# EAGLE design Adafruit 40pin TFT friend (EAGLE 8.3.2)
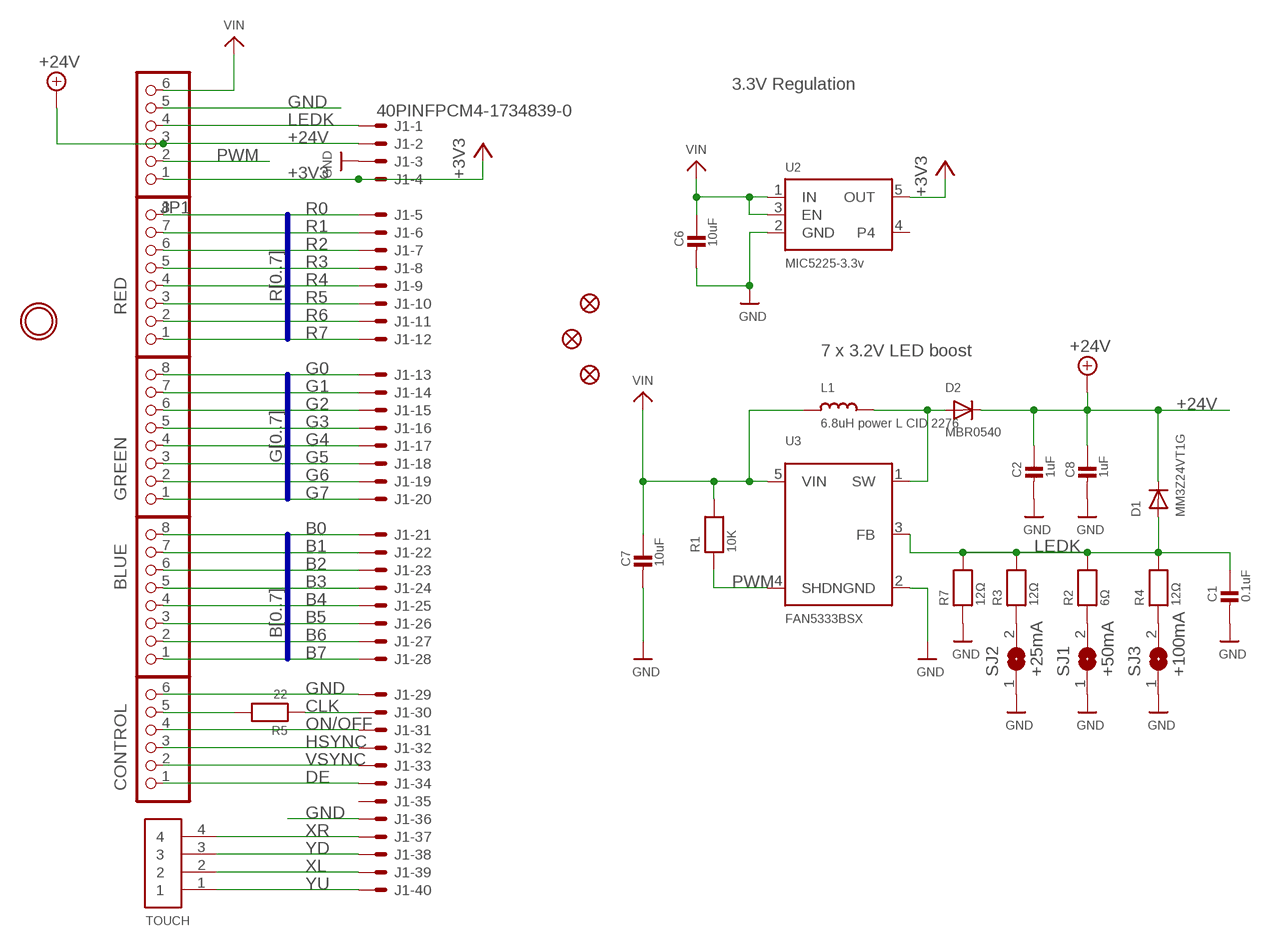
[diagram p0: schematic, sheet 1]

## Parts
BLUE  PINHD-1X8BIG  [1X08-BIG]
C1  0.1uF  CAP_CERAMIC_0805MP  [_0805MP]
C2  1uF  CAP_CERAMIC_0805MP  [_0805MP]
C6  10uF  CAP_CERAMIC_0805MP  [_0805MP]
C7  10uF  CAP_CERAMIC_0805MP  [_0805MP]
C8  1uF  CAP_CERAMIC_0805MP  [_0805MP]
CONTROL  PINHD-1X6B  [1X06-BIG]
D1  MM3Z24VT1G  DIODESMA  [SMADIODE]
D2  MBR0540  DIODESOD-123  [SOD-123]
FID1  FIDUCIAL""  [FIDUCIAL_1MM]
FID2  FIDUCIAL""  [FIDUCIAL_1MM]
FID3  FIDUCIAL""  [FIDUCIAL_1MM]
GREEN  PINHD-1X8BIG  [1X08-BIG]
J1  40PINFPCM4-1734839-0  [4-1734839-0]
JP1  PINHD-1X6B  [1X06-BIG]
L1  6.8uH power L CID 2276  INDUCTORNR5040  [INDUCTOR_5X5MM_NR5040_NOTHERMALS]
R1  10K  RESISTOR_0805MP  [_0805MP]
R2  6Ω  RESISTOR_0805MP  [_0805MP]
R3  12Ω  RESISTOR_0805MP  [_0805MP]
R4  12Ω  RESISTOR_0805MP  [_0805MP]
R5  22  RESISTOR_0805MP  [_0805MP]
R7  12Ω  RESISTOR_0805MP  [_0805MP]
RED  PINHD-1X8BIG  [1X08-BIG]
SJ1  +50mA  SOLDERJUMPER  [SOLDERJUMPER_ARROW_NOPASTE]
SJ2  +25mA  SOLDERJUMPER  [SOLDERJUMPER_ARROW_NOPASTE]
SJ3  +100mA  SOLDERJUMPER  [SOLDERJUMPER_ARROW_NOPASTE]
TOUCH  1X4-BIG  [1X04-BIG]
U2  MIC5225-3.3v  VREG_SOT23-5  [SOT23-5]
U3  FAN5333BSX  FAN5331  [SOT23-5@1]
U$7  MOUNTINGHOLE2.5  [MOUNTINGHOLE_2.5_PLATED]

## Nets
+3V3: J1.4 JP1.1 U2.5(OUT)
+24V: C2.1 C8.1 D1.C D2.C J1.2 JP1.3
B0: BLUE.8 J1.21
B1: BLUE.7 J1.22
B2: BLUE.6 J1.23
B3: BLUE.5 J1.24
B4: BLUE.4 J1.25
B5: BLUE.3 J1.26
B6: BLUE.2 J1.27
B7: BLUE.1 J1.28
CLK: J1.30 R5.1
DE: CONTROL.1 J1.34
G0: GREEN.8 J1.13
G1: GREEN.7 J1.14
G2: GREEN.6 J1.15
G3: GREEN.5 J1.16
G4: GREEN.4 J1.17
G5: GREEN.3 J1.18
G6: GREEN.2 J1.19
G7: GREEN.1 J1.20
GND: C1.2 C2.2 C6.2 C7.2 C8.2 CONTROL.6 J1.3 J1.29 J1.36 JP1.5 R7.1 SJ1.1 SJ2.1 SJ3.1 U2.2(GND) U3.2(GND)
HSYNC: CONTROL.3 J1.32
LEDK: C1.1 D1.A J1.1 JP1.4 R2.2 R3.2 R4.2 R7.2 U3.3(FB)
N$1: R2.1 SJ1.2
N$2: R3.1 SJ2.2
N$3: R4.1 SJ3.2
N$4: CONTROL.5 R5.2
N$5: D2.A L1.P$2 U3.1(SW)
ON/OFF: CONTROL.4 J1.31
PWM: JP1.2 R1.1 U3.4(SHDN)
R0: J1.5 RED.8
R1: J1.6 RED.7
R2: J1.7 RED.6
R3: J1.8 RED.5
R4: J1.9 RED.4
R5: J1.10 RED.3
R6: J1.11 RED.2
R7: J1.12 RED.1
VIN: C6.1 C7.1 JP1.6 L1.P$1 R1.2 U2.1(IN) U2.3(EN) U3.5(VIN)
VSYNC: CONTROL.2 J1.33
XL: J1.39 TOUCH.2
XR: J1.37 TOUCH.4
YD: J1.38 TOUCH.3
YU: J1.40 TOUCH.1
Unconnected: J1.35 U2.4

## Buses
R[0..7]
G[0..7]
B[0..7]

## Notes on the sheet
- 3.3V Regulation
- 7 x 3.2V LED boost

## Library data of the parts
BLUE GREEN RED = adafruit:PINHD-1X8: PIN HEADER
C1 C2 C6-C8 = microbuilder:CAP_CERAMIC: Ceramic Capacitors For new designs, use the packages preceded by an '_' character since they are more reliable: The following footprints should be used on most boards: _0402 - Standard footprint for regular board layouts _0603 - Standard footprint for regular board layouts _0805 - Standard footprint for regular board layouts For extremely tight-pitch boards where space is at a premium, the following 'micro-pitch' footprints can be used (smaller pads, no silkscreen outline, etc.): _0402MP - Micro-pitch footprint for very dense/compact boards _0603MP - Micro-pitch footprint for very dense/compact boards _0805MP - Micro-pitch footprint for very dense/compact boards Commonly Stocked Parts 0402 - 0402 Surface Mount Capacitors 16pF 50V 5% [Digikey: 445-4899-2-ND] 18pF 50V 5% [Digikey: 490-1281-2-ND] 22pF 50V 5% [Digikey: 490-1283-2-ND] 68pF 50V 5% [Digikey: 490-1289-2-ND] 0.1uF 10V 10% [Digikey: 490-1318-2-ND] 1.0uF 6.3V 10% [Digikey: 490-1320-2-ND] 0603 - 0603 Surface Mount Capacitors 16 pF 50V 5% [Digikey: 445-5051-2-ND] 22 pF 50V [Digikey: PCC220ACVTR-ND] 33 pF 50V 5% [Digikey: 490-1415-1-ND] 56pF 50V 5% [Digikey: 490-1421-1-ND] 220pF 50V 5% [Digikey: 445-1285-1-ND] 680 pF 50V 2200 pF 50V 5% C0G [Digikey: 445-1297-1-ND] 5600 pF 100V 5% X7R [Digikey: 478-3711-1-ND] 0.1 µF 25V 10% [Digikey: PCC2277TR-ND] 0.22 µF 16V 10% X7R [Digikey: 445-1318-1-ND] 1.0 µF 25V 10% [Digikey: 445-5146-2-ND] 0603 - RF Specific 3pF 250V +/-0.1pF RF [Digikey: 712-1347-1-ND] 18 pF 250V 5% [Digikey: 478-3505-1-ND or 712-1322-1-ND] 56 pF 250V 5% C0G RF [Digikey: 490-4867-1-ND] 68 pF 250V RF [Digikey: 490-4868-1-ND] 0805 - 0805 Surface Mount Capacitors 220 pF 250V 2% RF Ceramic Capacitor [Digikey: 712-1398-1-ND] 1000 pF 50V 2% NP0 Ceramic Capacitor [Digikey: 478-3760-1-ND] 0.1 µF 25V 10% Ceramic Capacitor [Digikey: PCC1828TR-ND] 1.0 µF 16V 10% Ceramic Capacitor[Digikey: 490-1691-2-ND] 10.0 µF 10V 10% Ceramic Capacitor[Digikey: 709-1228-1-ND] 10.0 uF 16V 10% Ceramic Capacitor [Digikey: 478-5165-2-ND] 47 uF 6.3V 20% Ceramic Capacitor [Digikey: 587-1779-1-ND or 399-5506-1-ND] 1206 - 1206 Surface Mount Capacitors 47uF 10V 20% Ceramic Capacitor [Digikey: 490-5528-1-ND or 399-5508-1-ND or 445-6010-1-ND] 100uF 6.3V -20%, +80% Y5V Ceramic Capacitor (Digikey: 490-4512-1-ND, Mouser: 81-GRM31CF50J107ZE1L)
CONTROL JP1 = adafruit:PINHD-1X6: PIN HEADER
D1 D2 = microbuilder:DIODE: Diode SMA Model Volts Amps Type Vf Vr Digikey # Notes SSA34-E3 40V 3A Schottky 480mV @ 3A 200uA @ 40V SSA34-E3/61TGITR-ND CDBA120-G 20V 1A Schottky 500mV @ 1A 500uA @ 20V 641-1014-6-ND REEL MBRA210 10V 2A Schottky 350mV @ 2A 700uA @ 10V MBRA210LT3 SOD-123 Model Volts Amps Type Vf Vr Order # Notes BAT54T1G 30V 200mA Schottky 800mV @ 200mA 2uA @ 25V BAT54T1GOSTR-ND B0530W 30V 500mA Schottky 430mV @ 500mA 130uA @ 30V B0530W-FDICT-ND REEL MBR120 20V 1A Schottky 340mV @ 1A MBR120VLSFT1GOSCT-ND SOD-323 Model Volts Amps Type Vf Vr Order # Notes PMEG2005EJ 20V 500mA Schottky 355mV @ 500mA 568-4110-1-ND ZLLS410 10V 570mA Schottky 380mV @ 570mA ZLLS410CT-ND 1N4148WS 75V 150mA Silicon/Simple 1V 1N4148WSFSCT-ND REEL SOD-523 Model Volts Amps Type Vf Vr Order # Notes BAT54XV2 30V 200mA Schottky 0.8V @ 100mA BAT54XV2CT-ND TB751S 30V 30mA Schottky RB751S-40TE61CT-ND SOT23-R/W (R = Solder Paste/Reflow Ovens, W = Hand-Soldering) Model Volts Amps Type Vf Vr Order # Notes BAT54FILM 40V 300mA Schottky 497-7162-1-ND
FID1-FID3 = microbuilder:FIDUCIAL: Fiducial Alignment Points Various fiducial points for machine vision alignment.; BOM: EXCLUDE
J1 = adafruit:40PINFPC: OMRON FPC Connector Source : http://www.omron.com/ecb/products/pdf/fpc.pdf XF2M-4015-rev is good for connecting up 'PSP' SHARP LQ043 LCDs
L1 = microbuilder:INDUCTOR: Inductors 0603: 10nH Ceramic Inductor - microwire antenna/RF (Digikey: 712-1434-2-ND) 0805: 560nH Ceramic Inductor - RF (Digikey: 553-1047-1-ND) 270nH Ceramic Inductor - Q = 40@250MHz, +-5%, 1 Ohm DC Resistance (Digikey: 535-10506-2-ND) 1007 (2518 Metric) SMT: 10µH 10% 250mOhm 820mA 1007 Inductor (Digikey: 587-2189-1-ND) 22µH 10% 500mOhm 580mA 1007 Inductor (Digikey: 587-2190-1-ND) 47µH 10% 950mOhm 420mA 1007 Inductor (Digikey: 587-2191-1-ND) 47µH 5% 100mOhm 1A 1008 Inductor (Digikey: 732-1816-1-ND) 5.0x5.0mm (Taiyo Yuden NR5040 Series) 6.8µH 20% 2.3A 64mOhm Inductor (Digikey: 587-2374-2-ND) 5.0x5.0mm (TDK VLC5045 Series) 4.7µH 20% 3.3A 34mOhm Inductor (Digikey: 445-6526-1-ND) 6.8µH 20% 2.7A 46mOhm Inductor (Digikey: 445-6527-1-ND) 6.0x6.0mm (TDK VLC6045 Series) 4.7µH 20% 3.8A 27mOhm Inductor (Digikey: 445-6538-2-ND) 6.8µH 20% 3A 41mOhm Inductor (Digikey: 445-6540-1-ND) 6.2µH 30% 2.2A 45mOhm Inductor (Digikey: SRR5028-6R2YCT-ND) - Not TDK VLC6045 but footprint should match 6.0x6.0mm (TDK SLF6045 Series) 6.8uH 30% 2A 33mOhm Inductor (Digikey: 445-4572-1-ND, Mouser: 810-SLF645T6R8N2R0PF) 6.0x6.0mm (Sumida CDRH5D28 Series) 6.2uH 30% 1.8A 45mOhm Inductor (Digikey: 308-1542-1-ND) Taiyo Yuden NR3015T2R2M - 2.2uH 20% 1.5A (Digikey: 587-1648-2-ND, Mouser: 963-NR3015T2R2M) - Used with TI TPS62172 CoilCraft RFID Transponder Coil - MA5532-AE (For use with AS3935 Lightning Sensor)
R1-R5 R7 = microbuilder:RESISTOR: Resistors For new designs, use the packages preceded by an '_' character since they are more reliable: The following footprints should be used on most boards: _0402 - Standard footprint for regular board layouts _0603 - Standard footprint for regular board layouts _0805 - Standard footprint for regular board layouts For extremely tight-pitch boards where space is at a premium, the following 'micro-pitch' footprints can be used (smaller pads, no silkscreen outline, etc.): _0402MP - Micro-pitch footprint for very dense/compact boards _0603MP - Micro-pitch footprint for very dense/compact boards _0805MP - Micro-pitch footprint for very dense/compact boards
SJ1-SJ3 = microbuilder:SOLDERJUMPER: SMD Solder JUMPER Solder the two pads together to create a connection, or remove the solder to break it. REFLOW - Use this footprint for solder paste and reflow ovens. WAVE - Use this footprint for hand-soldering (larger pads). CLOSED - Has a trace between the two pads to ensure it is closed by default. The trace needs to be cut to disable the jumper, and can be closed again by creating a solder bridge between the two pads.; BOM: EXCLUDE
TOUCH = adafruit:1X4: 4-pin connector
U2 = microbuilder:VREG_SOT23-5: SOT23-5 Fixed Voltage Regulators Part Current Out V Out V In V Dropout θJA (°C/W) TJ (°C) Digikey Part No. ADP121 150mA 3.3V 3.4-5.5V 0.09V @ 150mA -- -- ADP121-AUJZ33R7CT-ND ADP121 150mA 3.0V 3.1-5.5V 0.09V @ 150mA -- -- ADP121-AUJZ30R7CT-ND ADP122 300mA 3.3V 3.4-5.5V 0.085V @ 300mA -- -- ADP122AUJZ-3.3-R7CT-ND ADP1712 300mA 3.3V 3.5-5.5V 0.17V @ 300mA -- -- ADP1712AUJZ-3.3-R7TR-ND AP7311 (Low Cost) 150mA 3.3V 3.5-6V 0.15V @ 150mA -- -- AP7311-33WG-7DICT-ND LD39015M18R 150mA 1.8V 1.9V-5.5V 0.08V @ 100mA -- -- 497-6977-1-ND LP2985A-33DBVR 150mA 3.3V 3.3-16V 0.28V @ 150mA 206 150 296-18479-1-ND MCP1824T-3302E/OT 300mA 3.3V 3.5V-6V 0.2V @ 300mA -- -- MCP1824T-3302E/OTCT-ND MIC5205-2.5YM5 TR 150mA 2.5V 2.7-16V 0.165V @ 150mA -- -- 576-1257-2-ND MIC5205-3.0YM5 TR 150mA 3.0V 3.2V-16V 0.165V @ 150mA -- -- 576-1258-2-ND MIC5205-3.3YM5 TR 150mA 3.3V 3.5V-16V 0.165V @ 150mA -- -- 576-1259-2-ND TPS780330220 150mA 3.3V+2.2V 3.6-5.5V 250mV Max -- -- 296-23332-1-ND TDA3663/N1,135 100mA 3.3V 3.5-45V 0.18V @ 50mA -- -- 568-5343-1-ND Max operating temp can be calculated using θJA, TJ (max junction temperature), and power in watts. Set the "Maximum Ambient Temperature" until it reaches TJ ("Max Junction Temperature"), which is the absolute limit for safe use of the regulator: Heat Sink Temperature Calculator <http://www.daycounter.com/Calculators/Heat-Sink-Temperature-Calculator.phtml> For example, With 12V source into a 3.3V LP2985 and a 30mA load, we are dissipating (12V-3.3V) * 0.03A = 0.261W. With a θJA of 206 °C/W, a TJ of 150°C, and 261mW we can safely use the chip without a heat sink up to 75°C (=147.1°C Junction Temperature).
U3 = microbuilder:FAN5331: FAN5331 - LED/OLED 20V Boost Converter Digikey: FAN5331SXCT-ND
U$7 = microbuilder:MOUNTINGHOLE: Mounting Hole For #2 screws (0.086"/2.18mm width, 0.094"/2.4mm hole) use 2.5mm; BOM: EXCLUDE

## Board
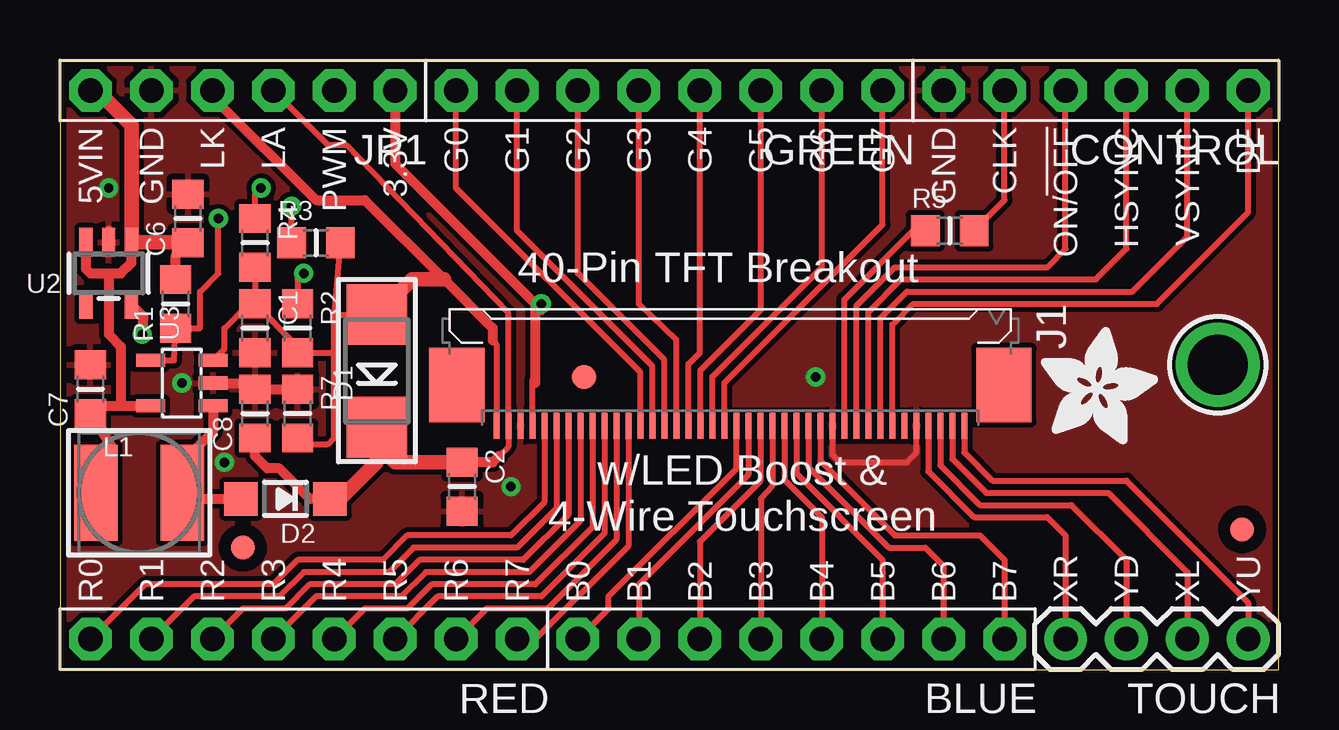
[diagram p1: board, top side]
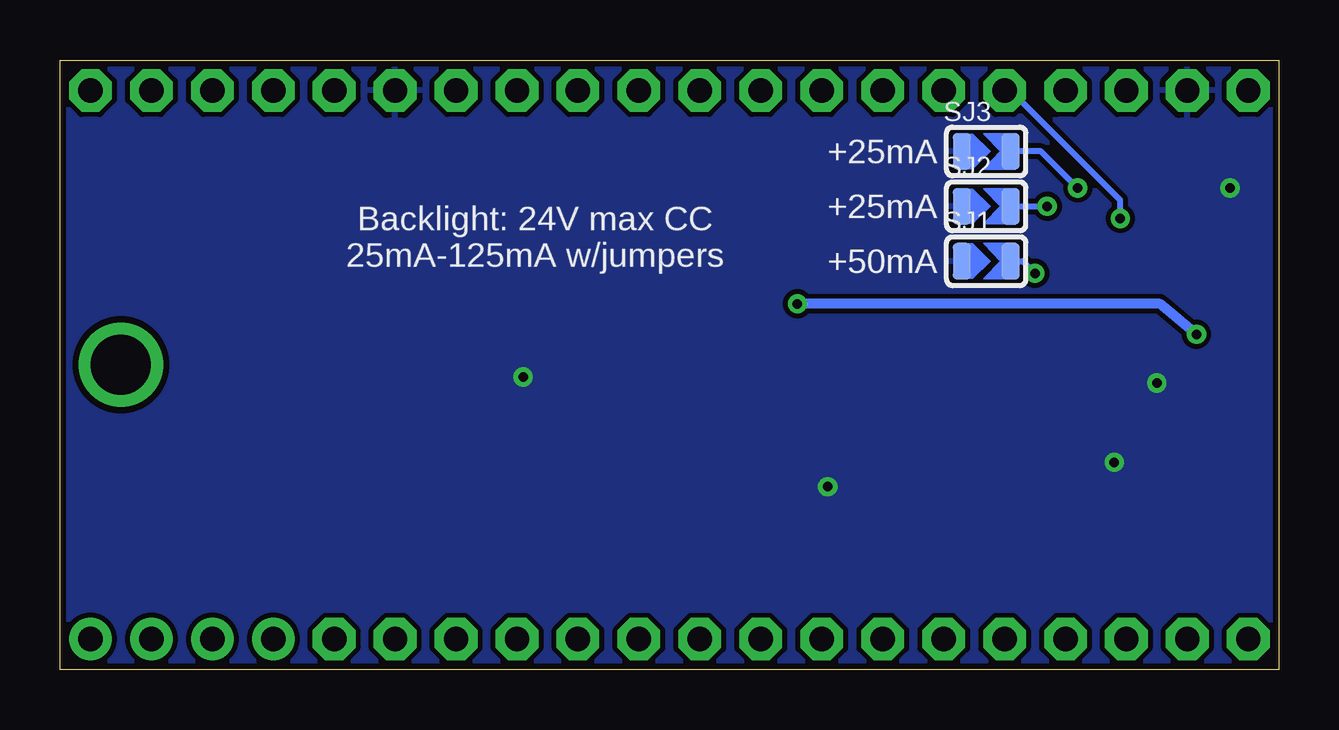
[diagram p2: board, bottom side, seen from below]

Size 50.8 x 25.4 mm. Coordinates in mm from the lower left corner, seen from the top.
Outline: 0,0 50.8,0 50.8,25.4 0,25.4 0,0
Copper layers (1*16): Top 0.035mm / dielectric 1.5mm / Bottom 0.035mm
Design rules "adafruit": minimum track width 8mil, minimum drill 15.5mil, track to track 8mil, track to pad 8mil, pad to pad 8mil, via to via 8mil, smd to smd 8mil, copper to edge 10mil, drill to drill 8mil, minimum pad ring 10mil, minimum via ring 8mil, stop-mask expansion 4mil, vias tented up to drill 20mil, thermal gap 10mil

### Footprints (pad centres in the part's own frame; a part is rotated, then mirrored left to right if it is on the bottom)
1X08-BIG = drill 1.016 pad 1.778 octagon: 1 -8.89,0; 2 -6.35,0; 3 -3.81,0; 4 -1.27,0; 5 1.27,0; 6 3.81,0; 7 6.35,0; 8 8.89,0
_0805MP = smd 1.2 x 1.3: 1 -1.016,0; 2 1.016,0
1X06-BIG = drill 1.016 pad 1.778 octagon: 1 -6.35,0; 2 -3.81,0; 3 -1.27,0; 4 1.27,0; 5 3.81,0; 6 6.35,0
SMADIODE = smd 2.54 x 2.54: A 2.349,0; C -2.349,0
SOD-123 = smd 1.4 x 1.4: A 1.85,0; C -1.85,0
FIDUCIAL_1MM = smd 1 x 1: 1 0,0
4-1734839-0 = smd 0.25 x 1.1: 1 -9.75,-2.54; 2 -9.25,-2.54; 3 -8.75,-2.54; 4 -8.25,-2.54; 5 -7.75,-2.54; 6 -7.25,-2.54; 7 -6.75,-2.54; 8 -6.25,-2.54; 9 -5.75,-2.54; 10 -5.25,-2.54; 11 -4.75,-2.54; 12 -4.25,-2.54; 13 -3.75,-2.54; 14 -3.25,-2.54; 15 -2.75,-2.54; 16 -2.25,-2.54; 17 -1.75,-2.54; 18 -1.25,-2.54; 19 -0.75,-2.54; 20 -0.25,-2.54; 21 0.25,-2.54; 22 0.75,-2.54; 23 1.25,-2.54; 24 1.75,-2.54; 25 2.25,-2.54; 26 2.75,-2.54; 27 3.25,-2.54; 28 3.75,-2.54; 29 4.25,-2.54; 30 4.75,-2.54; 31 5.25,-2.54; 32 5.75,-2.54; 33 6.25,-2.54; 34 6.75,-2.54; 35 7.25,-2.54; 36 7.75,-2.54; 37 8.25,-2.54; 38 8.75,-2.54; 39 9.25,-2.54; 40 9.75,-2.54 | smd 2.3 x 3.1: M1 11.4,-0.84; M2 -11.4,-0.84
INDUCTOR_5X5MM_NR5040_NOTHERMALS = smd 1.8 x 4: P$1 -1.8,0; P$2 1.8,0
SOLDERJUMPER_ARROW_NOPASTE = smd 0.762 x 1.524: 1 -1.016,0; 2 1.016,0
1X04-BIG = drill 1.016 pad 1.778: 1 0,0; 2 2.54,0; 3 5.08,0; 4 7.62,0
SOT23-5 = smd 0.55 x 1.2: 1 -0.95,-1.3; 2 0,-1.3; 3 0.95,-1.3; 4 0.95,1.3; 5 -0.95,1.3
SOT23-5@1 = smd 0.55 x 1.2: 1 -0.95,-1.3; 2 0,-1.3; 3 0.95,-1.3; 4 0.95,1.3; 5 -0.95,1.3
MOUNTINGHOLE_2.5_PLATED = drill 2.5 pad 3.2: P$1 0,0

### Placement (x,y rotation side)
BLUE  30.48,1.27 180 top
C1  8.13,14.22 270 top
C2  16.76,7.62 270 top
C6  5.33,18.8 90 top
C7  1.27,11.68 90 top
C8  8.13,10.67 90 top
CONTROL  43.18,24.13 180 top
D1  13.21,12.45 90 top
D2  9.4,7.11 180 top
FID1  49.28,5.84 0 top
FID2  7.62,5.08 0 top
FID3  21.84,12.19 0 top
GREEN  25.4,24.13 180 top
J1  27.94,12.7 0 top
JP1  7.62,24.13 180 top
L1  3.3,7.37 0 top
R1  4.83,15.24 90 top
R2  9.91,14.22 270 top
R3  10.67,17.78 0 top
R4  8.13,17.78 270 top
R5  37.08,18.29 0 top
R7  9.91,10.67 270 top
RED  10.16,1.27 180 top
SJ1  12.19,17.02 0 bottom
SJ2  12.19,19.3 0 bottom
SJ3  12.19,21.59 0 bottom
TOUCH  49.53,1.27 180 top
U2  2.03,16.51 180 top
U3  5.08,11.94 90 top
U$7  48.26,12.7 0 top
U$15  [ADAFRUIT_5MM]  40.89,9.4 0 top

### Tracks (layer width: path | path; a pad name or v marks a point on that pad's centre or on a via)
+3V3  (via drill 0.39)
  Top 0.254: J1.4 19.69,12.06 19.81,11.94
  Top 0.406: JP1.1 13.97,21.08 19.81,15.24 19.81,14.99 | 19.81,14.99 19.81,11.94 | U2.5 3.46,14.73 v3.43,13.97 | v20.07,15.24 20.07,14.99 19.81,14.99
  Bottom 0.406: v3.43,13.97 4.95,15.24 v20.07,15.24
+24V
  Top 0.254: 18.29,8.89 18.69,9.29 J1.2 18.69,14.84 11.94,21.84 11.18,21.84 JP1.3
  Top 0.406: C8.1 8.13,8.89 8.64,8.38 9.14,8.38 10.41,7.11 D2.C 11.68,7.11 | 18.29,8.89 18.03,8.64 C2.1
  Top 0.61: 11.68,7.11 13.21,8.64 13.21,9.4 | 13.21,9.4 D1.C | C2.1 13.97,8.64 13.21,9.4
B0
  Top 0.254: BLUE.8 22.86,2.54 22.86,3.05 28.19,8.38 J1.21
B1
  Top 0.254: J1.22 28.69,8.12 24.13,3.56 BLUE.7
B2
  Top 0.254: 26.65,1.29 BLUE.6 26.67,5.33 29.19,7.85 J1.23
B3
  Top 0.254: J1.24 29.69,7.65 29.21,7.11 BLUE.5
B4
  Top 0.254: J1.25 30.19,7.91 31.75,6.35 BLUE.4
B5
  Top 0.254: J1.26 30.69,8.17 34.29,4.57 BLUE.3
B6
  Top 0.254: J1.27 31.19,8.43 34.54,5.08 36.07,5.08 36.83,4.32 BLUE.2
B7
  Top 0.254: J1.28 31.69,8.7 34.8,5.59 38.35,5.59 39.37,4.57 BLUE.1
CLK
  Top 0.254: R5.1 35.56,18.29 32.69,15.42 J1.30
DE
  Top 0.254: J1.34 34.69,14.37 35.56,15.24 45.72,15.24 49.53,19.05 CONTROL.1
G0
  Top 0.254: J1.13 24.19,12.39 16.51,20.07 GREEN.8
G1
  Top 0.254: J1.14 24.69,12.65 19.05,18.29 GREEN.7
G2
  Top 0.254: J1.15 25.19,12.91 21.59,16.51 GREEN.6
G3
  Top 0.254: J1.16 25.69,13.75 24.13,15.24 GREEN.5
G4
  Top 0.254: J1.17 26.19,12.73 26.67,13.21 GREEN.4
G5
  Top 0.254: J1.18 26.69,12.47 29.21,14.99 GREEN.3
G6
  Top 0.254: J1.19 27.19,12.2 31.75,16.76 GREEN.2
G7
  Top 0.254: J1.20 27.69,11.94 34.29,18.54 GREEN.1
GND  (via drill 0.39)
  Top 0.254: J1.29 32.19,8.96 32.51,8.64 35.31,8.64 35.69,9.02 J1.36
  Top 0.406: 2.03,18.29 U2.2 | R7.1 C8.2 8.13,11.94 U3.2
  other vias: 31.5,12.19 2.03,20.07 5.08,11.94 18.8,7.62 6.86,8.64
  pour Top: 0,25.4 0,0 50.8,0 50.8,25.4
  pour Bottom: 0,25.4 0,0 50.8,0 50.8,25.4
HSYNC
  Top 0.254: J1.32 33.69,14.89 35.05,16.26 43.18,16.26 44.45,17.53 CONTROL.3
LEDK
  Top 0.254: 18.03,13.72 18.19,13.56 J1.1 | U3.3 6.86,13.37 6.86,14.22 7.87,15.24 C1.1 | 11.43,14.8 D1.A | R7.2 10.16,9.4 11.18,9.4 11.43,9.65 11.43,13.21 | 11.43,13.21 11.43,14.8 | C1.1 9.91,13.46 R2.2 11.43,13.21 | R3.2 11.43,14.8 | R4.2 C1.1
  Top 0.406: JP1.4 6.35,23.88 10.67,19.56 12.7,19.56 16,16.26 18.03,14.22 18.03,13.72 | R7.2 10.16,9.65
  Top 0.61: D1.A 14.67,16.26 16,16.26
N$1  (via drill 0.39)
  Top 0.254: v10.16,16.51 9.91,16.26 R2.1
  Bottom 0.254: SJ1.2 10.67,17.02 v10.16,16.51
N$2  (via drill 0.39)
  Top 0.254: R3.1 v9.65,19.3
  Bottom 0.254: SJ2.2 v9.65,19.3
N$3  (via drill 0.39)
  Top 0.254: R4.1 8.13,19.81 v8.38,20.07
  Bottom 0.254: v8.38,20.07 9.91,21.59 SJ3.2
N$4
  Top 0.254: R5.2 39.37,19.56 CONTROL.5
N$5
  Top 0.406: D2.A 5.33,7.11 L1.P$2 5.08,7.39 5.08,8.64 6.38,9.94 U3.1
ON/OFF
  Top 0.254: J1.31 33.19,15.16 34.8,16.76 41.15,16.76 41.91,17.53 CONTROL.4
PWM  (via drill 0.39)
  Top 0.254: U3.4 4.76,12.89 R1.1 5.84,14.22 5.84,15.75 6.6,16.51 v6.6,18.8
  Bottom 0.254: v6.6,18.8 6.6,19.56 10.92,23.88 11.18,23.88 JP1.2
R0
  Top 0.254: J1.5 20.19,6.98 18.8,5.59 14.48,5.59 13.46,4.57 9.91,4.57 8.89,3.56 3.56,3.56 RED.8
R1
  Top 0.254: J1.6 20.69,6.72 19.05,5.08 14.73,5.08 13.72,4.06 10.16,4.06 9.14,3.05 5.59,3.05 RED.7
R2
  Top 0.254: J1.7 21.19,6.46 19.3,4.57 14.99,4.57 13.97,3.56 10.41,3.56 9.4,2.54 7.62,2.54 RED.6
R3
  Top 0.254: J1.8 21.69,6.2 19.56,4.06 15.24,4.06 14.22,3.05 10.67,3.05 RED.5
R4
  Top 0.254: J1.9 22.19,5.93 19.81,3.56 15.49,3.56 14.48,2.54 12.7,2.54 RED.4
R5
  Top 0.254: 13.97,1.02 RED.3 15.75,3.05 20.07,3.05 22.69,5.67 J1.10
R6
  Top 0.254: 16.51,1.02 RED.2 17.78,2.54 20.32,2.54 23.19,5.41 J1.11
R7
  Top 0.254: J1.12 23.69,5.15 19.81,1.27 RED.1
VIN
  Top 0.254: 3.05,17.02 2.98,16.95
  Top 0.406: 2.98,18.22 U2.1 2.98,16.95 2.54,16.51 2.03,16.51 | U2.3 1.08,16.7 1.27,16.51 2.03,16.51 | 2.54,10.99 1.34,10.99 C7.1 2.17,9.26 L1.P$1 | 2.54,10.99 U3.5 | 2.03,16.51 2.03,13.97 2.54,13.46 2.54,10.99 | R1.2 4.83,17.27 C6.1
  Top 0.61: JP1.6 1.52,24.13 2.98,22.67 U2.1 5.56,17.81 C6.1
VSYNC
  Top 0.254: J1.33 34.19,14.63 35.31,15.75 44.7,15.75 46.99,18.03 CONTROL.2
XL
  Top 0.254: J1.39 37.19,8.78 38.61,7.37 43.69,7.37 46.99,4.06 TOUCH.2
XR
  Top 0.254: J1.37 36.19,8.26 38.1,6.35 41.15,6.35 41.91,5.59 TOUCH.4
YD
  Top 0.254: J1.38 36.69,8.52 38.35,6.86 42.16,6.86 44.45,4.57 TOUCH.3
YU
  Top 0.254: J1.40 37.69,9.05 38.86,7.87 44.45,7.87 49.53,2.79 TOUCH.1

### Text on the board
tPlace: 5VIN | GND | LK | LA | PWM | 3.3V | G0 | G1 | G2 | G3 | G4 | G5 | G6 | G7 | GND | CLK | ON/!OFF | HSYNC | VSYNC | DE | 40-Pin TFT Breakout | w/LED Boost & / 4-Wire Touchscreen | R0 | R1 | R2 | R3 | R4 | R5 | R6 | R7 | B0 | B1 | B2 | B3 | B4 | B5 | B6 | B7 | XR | YD | XL | YU
bPlace: +25mA | +25mA | +50mA | Backlight: 24V max CC / 25mA-125mA w/jumpers